# EAGLE design remote_handmade (EAGLE 6.4)
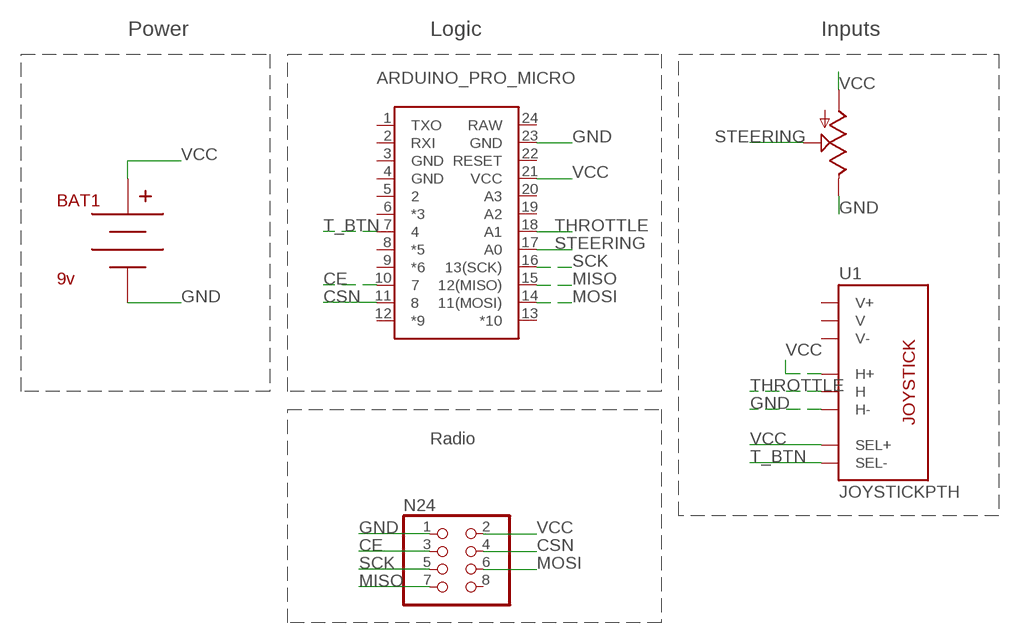
[diagram p0: schematic, sheet 1]

## Parts
ARDUINO_PRO_MICRO  ARDUINO_PRO_MICRONORMALNORMAL  [ARDUINO_PRO_MICRO]
BAT1  9v  BC9VPC  [BC9VPC]
N24  NRF24  PINHD-2X4  [2X04]
RV1  POT  [ALPS_POT]
U1  JOYSTICKPTH  [JOYSTICK]

## Nets
CE: ARDUINO_PRO_MICRO.10 N24.3
CSN: ARDUINO_PRO_MICRO.11 N24.4
GND: ARDUINO_PRO_MICRO.23(GND) BAT1.V- N24.1 RV1.P$1(E) U1.H3(H-)
MISO: ARDUINO_PRO_MICRO.15(12(MISO)) N24.7
MOSI: ARDUINO_PRO_MICRO.14(11(MOSI)) N24.6
SCK: ARDUINO_PRO_MICRO.16(13(SCK)) N24.5
STEERING: ARDUINO_PRO_MICRO.17(A0) RV1.P$2(S)
T_BTN: ARDUINO_PRO_MICRO.7 U1.B2A(SEL-)
THROTTLE: ARDUINO_PRO_MICRO.18(A1) U1.H2(H)
VCC: ARDUINO_PRO_MICRO.21(VCC) BAT1.V+ N24.2 RV1.P$3(A) U1.B1A(SEL+) U1.H1(H+)
Unconnected: ARDUINO_PRO_MICRO.1(TXO) ARDUINO_PRO_MICRO.2(RXI) ARDUINO_PRO_MICRO.3(GND) ARDUINO_PRO_MICRO.4(GND) ARDUINO_PRO_MICRO.5 ARDUINO_PRO_MICRO.6(*3) ARDUINO_PRO_MICRO.8(*5) ARDUINO_PRO_MICRO.9(*6) ARDUINO_PRO_MICRO.12(*9) ARDUINO_PRO_MICRO.13(*10) ARDUINO_PRO_MICRO.19(A2) ARDUINO_PRO_MICRO.20(A3) ARDUINO_PRO_MICRO.22(RESET) ARDUINO_PRO_MICRO.24(RAW) N24.8 U1.V1(V+) U1.V2(V) U1.V3(V-)

## Notes on the sheet
- Power | Logic | Inputs
- Radio

## Library data of the parts
ARDUINO_PRO_MICRO = SparkFun-Boards:ARDUINO_PRO_MICRO
BAT1 = SparkFun-Connectors:BC9VPC: 9V board-mount battery cradle; PROD_ID: BATT-10855
N24 = pinhead:PINHD-2X4: PIN HEADER
RV1 = SparkFun-Electromechanical:POT
U1 = SparkFun-Electromechanical:JOYSTICK: Thumb Joystick Joystick commonly found in PS2 controllers. Two pots and a select switch. Footprint proven. Spark Fun Electronics SKU : COM-09032

## Net classes
0 default: width 0.8 mm, clearance 0.8 mm

## Board
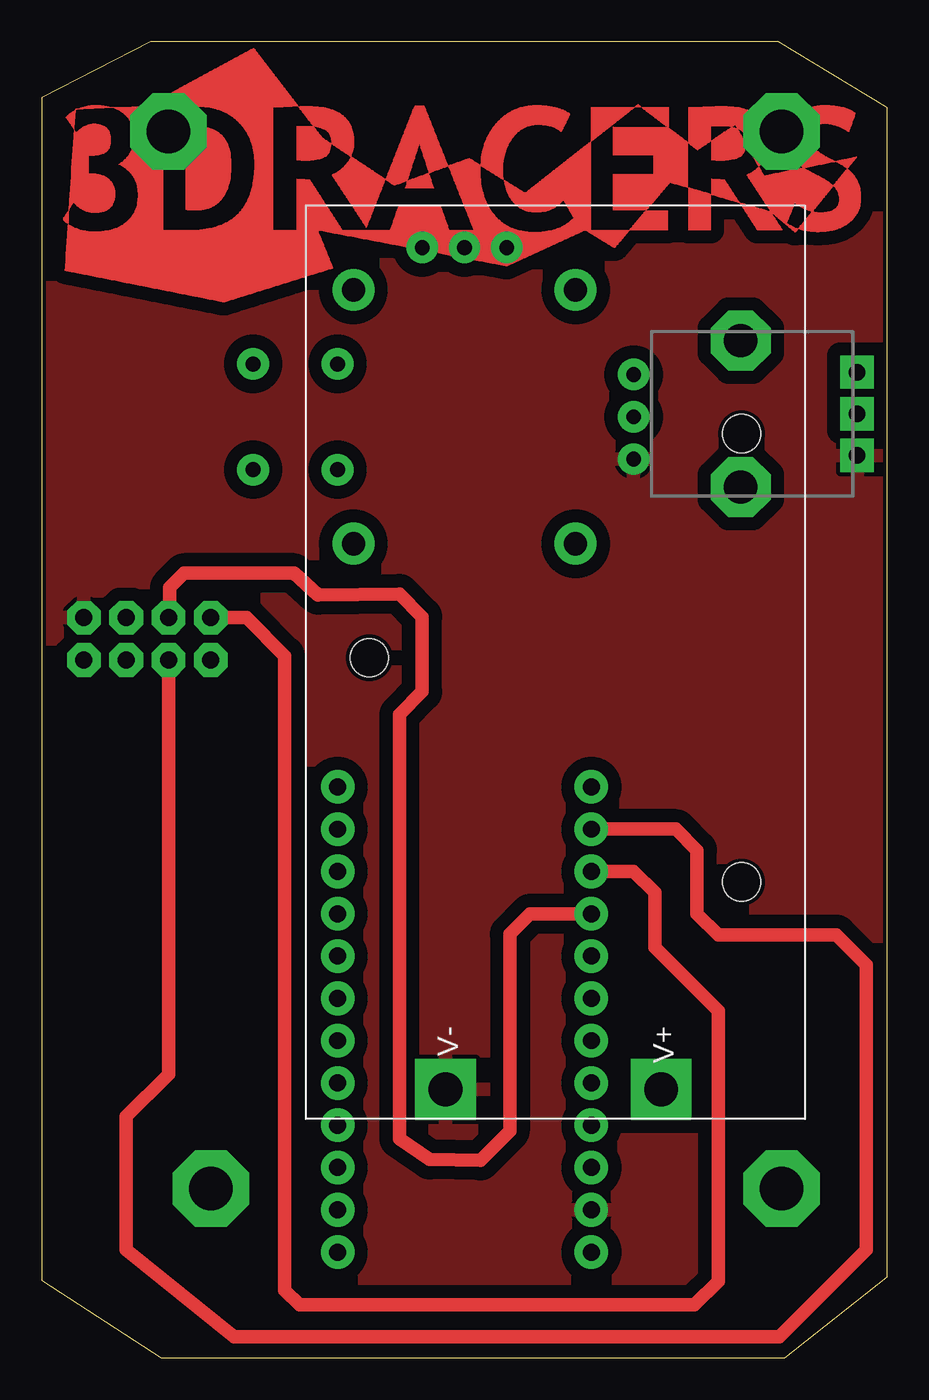
[diagram p1: board, top side]
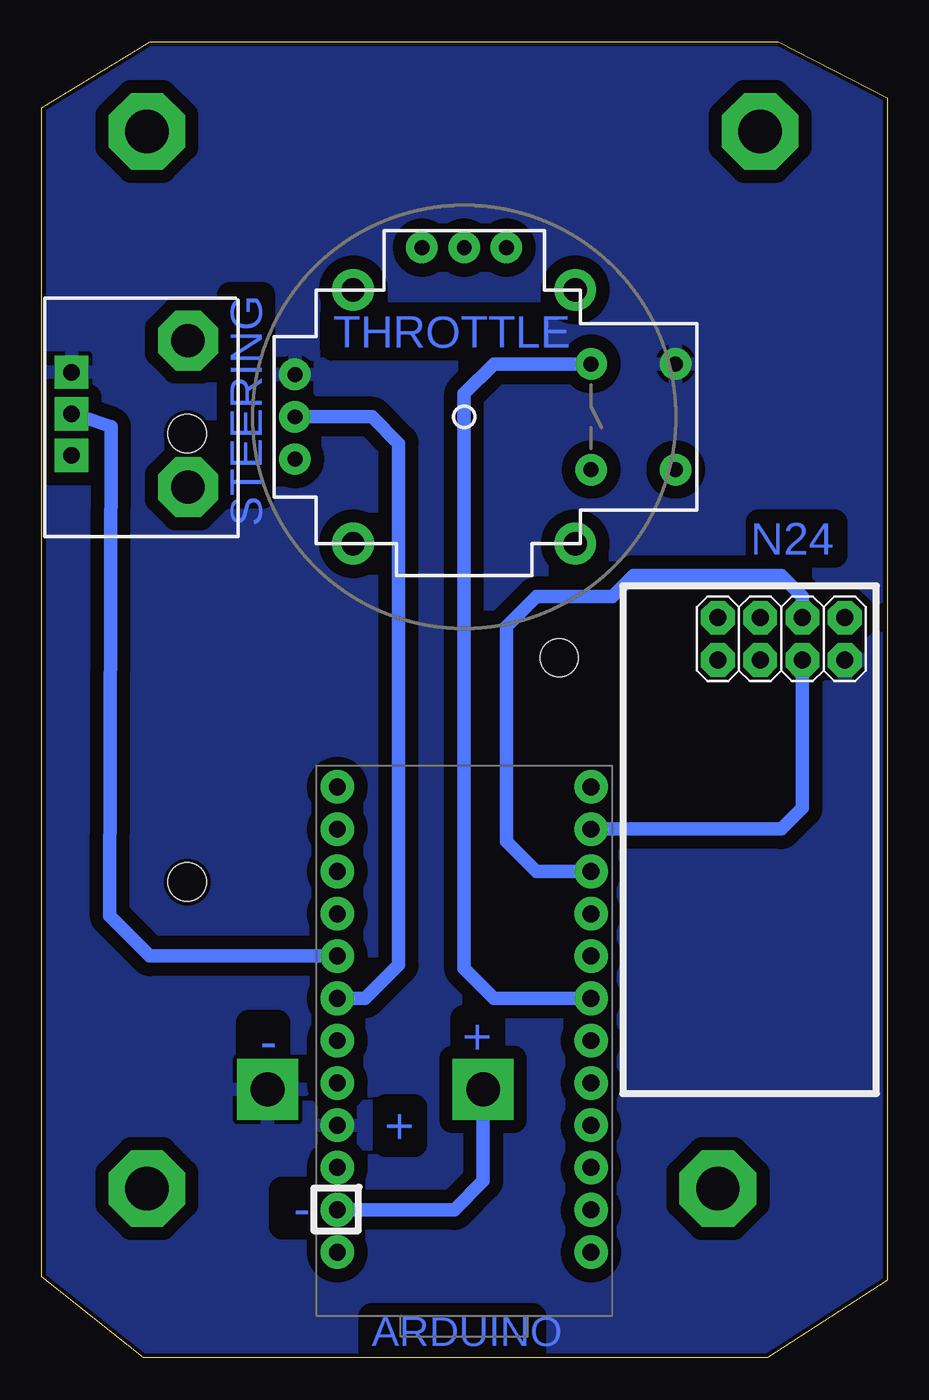
[diagram p2: board, bottom side, seen from below]

Size 50.78 x 79.05 mm. Coordinates in mm from the lower left corner, seen from the top.
Outline: 0,75.68 0,4.64 7.18,0 44.66,0 50.78,4.86 50.78,75.06 44.26,79.05 6.54,79.05 0,75.68
Copper layers (1*16): Top 0.035mm / dielectric 1.5mm / Bottom 0.035mm
Design rules "Handmade *": minimum track width 0.8mm, minimum drill 0.8mm, track to track 0.8mm, track to pad 0.8mm, pad to pad 0.45mm, via to via 0.8mm, smd to smd 8mil, copper to edge 10mil, drill to drill 8mil, minimum pad ring 0.5mm, minimum via ring 0.6mm, stop-mask expansion 0mil, vias tented up to drill 0mil, thermal gap 10mil

### Footprints (pad centres in the part's own frame; a part is rotated, then mirrored left to right if it is on the bottom)
ARDUINO_PRO_MICRO = drill 1.016 pad 1.88: 1 -7.62,12.7; 2 -7.62,10.16; 3 -7.62,7.62; 4 -7.62,5.08; 5 -7.62,2.54; 6 -7.62,0; 7 -7.62,-2.54; 8 -7.62,-5.08; 9 -7.62,-7.62; 10 -7.62,-10.16; 11 -7.62,-12.7; 12 -7.62,-15.24; 13 7.62,-15.24; 14 7.62,-12.7; 15 7.62,-10.16; 16 7.62,-7.62; 17 7.62,-5.08; 18 7.62,-2.54; 19 7.62,0; 20 7.62,2.54; 21 7.62,5.08; 22 7.62,7.62; 23 7.62,10.16; 24 7.62,12.7
BC9VPC = drill 2.032 square: V+ 53.086,21.336; V- 53.086,8.382 | hole 2.286: 27.178,3.81; 13.716,26.162; 40.64,26.162
2X04 = drill 1.016 octagon: 1 -3.81,-1.27; 2 -3.81,1.27; 3 -1.27,-1.27; 4 -1.27,1.27; 5 1.27,-1.27; 6 1.27,1.27; 7 3.81,-1.27; 8 3.81,1.27
ALPS_POT = drill 1 pad 1.88 square: P$1 7,-2.5; P$2 7,0; P$3 7,2.5 | drill 2 octagon: P$4 0,-4.4; P$5 0,4.4
JOYSTICK = drill 0.9 pad 1.778: B1A -3.175,12.7; B1B 3.175,12.7; B2A -3.175,7.62; B2B 3.175,7.62 | drill 0.889 pad 1.778: H1 -2.54,-10.16; H2 0,-10.16; H3 2.54,-10.16; V1 -10.16,2.54; V2 -10.16,0; V3 -10.16,-2.54 | drill 1.397 pad 2.286: MOUNT1 -7.62,6.668; MOUNT2 -7.62,-6.668; MOUNT3 7.62,-6.668; MOUNT4 7.62,6.668

### Placement (x,y rotation side)
ARDUINO_PRO_MICRO  25.4,19.05 180 bottom
BAT1  15.88,69.22 270 top
N24  6.35,43.18 180 bottom
RV1  41.99,56.69 0 top
U1  25.4,56.52 270 bottom

### Tracks (layer width: path | path; a pad name or v marks a point on that pad's centre or on a via)
CE
  Bottom 0.813: N24.3 5.08,45.72 6.35,46.99 15.24,46.99 16.51,45.72 21.06,45.72 22.86,43.92 22.86,31.01 21.06,29.21 ARDUINO_PRO_MICRO.10 19.05,29.21
CSN
  Bottom 0.813: N24.4 5.08,33.02 6.35,31.75 ARDUINO_PRO_MICRO.11
GND
  Bottom 0.813: BAT1.V- 24.26,10.63 26,8.89 ARDUINO_PRO_MICRO.23
  pour Top: -2.54,81.28 54.61,81.28 54.61,-2.54 -2.54,-2.54
MISO
  Top 0.813: N24.7 12.31,44.45 14.61,42.16 14.61,4.07 15.5,3.17 39.22,3.17 40.64,4.59 40.64,20.85 36.83,24.66 36.83,27.94 35.56,29.21 ARDUINO_PRO_MICRO.15
MOSI
  Top 0.813: N24.6 7.62,17.04 5.08,14.5 5.08,6.49 11.57,1.27 44.31,1.27 49.53,6.49 49.53,23.6 47.73,25.4 40.64,25.4 39.37,26.67 39.37,30.48 38.1,31.75 ARDUINO_PRO_MICRO.14
N$1  (via drill 2.6)
  other vias: 7.62,73.66
N$2  (via drill 2.6)
  other vias: 44.45,73.66
N$3  (via drill 2.6)
  other vias: 10.16,10.16
N$4  (via drill 2.6)
  other vias: 44.45,10.16
SCK
  Top 0.813: ARDUINO_PRO_MICRO.16 29.34,26.67 28.12,25.45 28.12,13.62 26.36,11.86 23.3,11.91 21.49,13.17 21.49,38.63 22.86,40.01 22.86,44.5 21.49,45.87 16.61,45.82 15.16,47.12 8.56,47.12 7.7,46.25 7.7,44.53 N24.5
STEERING
  Bottom 0.813: ARDUINO_PRO_MICRO.17 44.28,24.13 46.69,26.54 46.61,55.91 48.38,56.54 48.99,56.54 RV1.P$2
T_BTN
  Bottom 0.813: ARDUINO_PRO_MICRO.7 23.6,21.59 25.4,23.39 25.4,57.89 23.6,59.69 U1.B2A
THROTTLE
  Bottom 0.813: ARDUINO_PRO_MICRO.18 31.35,21.59 29.34,23.6 29.34,54.92 30.93,56.52 U1.H2
VCC
  pour Bottom: -1.27,82.55 55.88,82.55 55.88,-1.27 -1.27,-1.27
(copper drawn outside any net)
  shapes: Top area x4465

### Text on the board
Bottom: STEERING | THROTTLE | N24 | + | - | + | - | ARDUINO